# Altium schematic sheet DDR4_SODIMM_Arria10.SchDoc: DDR4 SODIMM Arria10
size B; DocumentNumber: 20; SheetNumber: 20; SheetTotal: 46
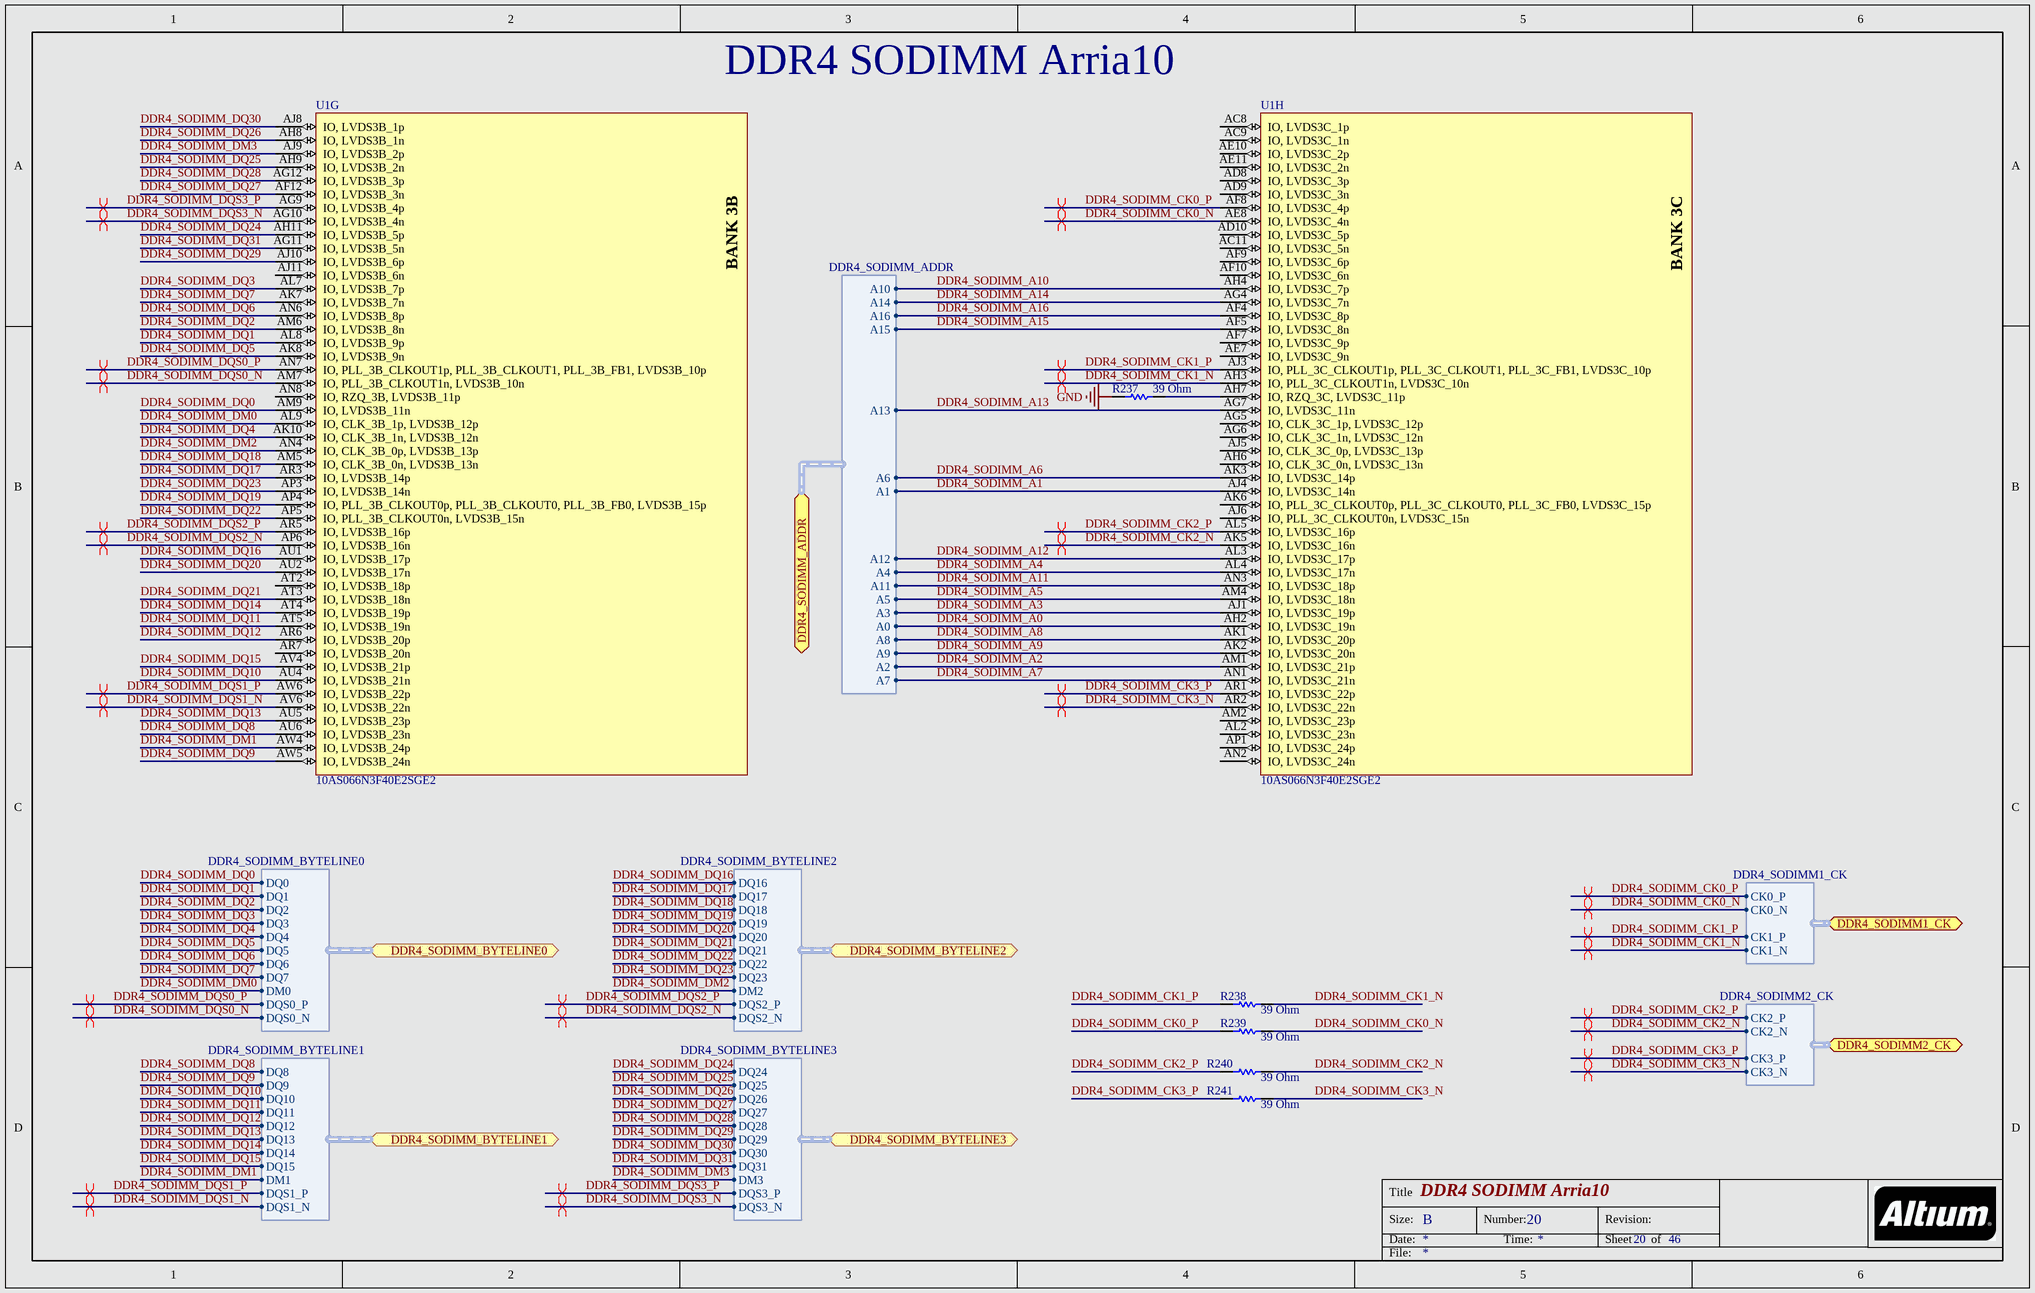
[diagram p0: DDR4_SODIMM_Arria10.SchDoc]

## Parts
R237  Resistance: 39 Ohm  [RESC1005X40X25NL5T10]  (hidden comment: RC0402JR-0739RL)
R238  Resistance: 39 Ohm  [RESC1005X40X25NL5T10]  (hidden comment: RC0402JR-0739RL)
R239  Resistance: 39 Ohm  [RESC1005X40X25NL5T10]  (hidden comment: RC0402JR-0739RL)
R240  Resistance: 39 Ohm  [RESC1005X40X25NL5T10]  (hidden comment: RC0402JR-0739RL)
R241  Resistance: 39 Ohm  [RESC1005X40X25NL5T10]  (hidden comment: RC0402JR-0739RL)
U1  10AS066N3F40E2SGE2  [ALTR-FBGA1517_A-350]  (parts G,H of 31)

## Ports
DDR4_SODIMM1_CK (harness DDR4_SODIMM1_CK), DDR4_SODIMM2_CK (harness DDR4_SODIMM2_CK), DDR4_SODIMM_ADDR (harness DDR4_SODIMM_ADDR), DDR4_SODIMM_BYTELINE0 (harness DDR4_SODIMM_BYTELINE0), DDR4_SODIMM_BYTELINE1 (harness DDR4_SODIMM_BYTELINE1), DDR4_SODIMM_BYTELINE2 (harness DDR4_SODIMM_BYTELINE2), DDR4_SODIMM_BYTELINE3 (harness DDR4_SODIMM_BYTELINE3)

## Harnesses
DDR4_SODIMM_ADDR: A10, A14, A16, A15, A13, A3, A0, A6, A1, A8, A9, A2, A7, A12, A4, A11, A5
DDR4_SODIMM1_CK: CK0_N, CK0_P, CK1_P, CK1_N
DDR4_SODIMM2_CK: CK2_N, CK2_P, CK3_P, CK3_N
DDR4_SODIMM_BYTELINE0: DQ0, DQ1, DQ2, DQ3, DQ4, DQ5, DQ6, DQ7, DM0, DQS0_P, DQS0_N
DDR4_SODIMM_BYTELINE1: DQ8, DQ9, DQ10, DQ11, DQ12, DQ13, DQ14, DQ15, DM1, DQS1_P, DQS1_N
DDR4_SODIMM_BYTELINE2: DQ16, DQ17, DQ18, DQ19, DQ20, DQ21, DQ22, DQ23, DM2, DQS2_P, DQS2_N
DDR4_SODIMM_BYTELINE3: DQ24, DQ25, DQ26, DQ27, DQ28, DQ29, DQ30, DQ31, DM3, DQS3_P, DQS3_N

## Nets
GND: R237.1
DDR4_SODIMM_A0: U1.AH2(IO,_LVDS3C_19n) ; port DDR4_SODIMM_ADDR.A0
DDR4_SODIMM_A1: U1.AJ4(IO,_LVDS3C_14n) ; port DDR4_SODIMM_ADDR.A1
DDR4_SODIMM_A2: U1.AM1(IO,_LVDS3C_21p) ; port DDR4_SODIMM_ADDR.A2
DDR4_SODIMM_A3: U1.AJ1(IO,_LVDS3C_19p) ; port DDR4_SODIMM_ADDR.A3
DDR4_SODIMM_A4: U1.AL4(IO,_LVDS3C_17n) ; port DDR4_SODIMM_ADDR.A4
DDR4_SODIMM_A5: U1.AM4(IO,_LVDS3C_18n) ; port DDR4_SODIMM_ADDR.A5
DDR4_SODIMM_A6: U1.AK3(IO,_LVDS3C_14p) ; port DDR4_SODIMM_ADDR.A6
DDR4_SODIMM_A7: U1.AN1(IO,_LVDS3C_21n) ; port DDR4_SODIMM_ADDR.A7
DDR4_SODIMM_A8: U1.AK1(IO,_LVDS3C_20p) ; port DDR4_SODIMM_ADDR.A8
DDR4_SODIMM_A9: U1.AK2(IO,_LVDS3C_20n) ; port DDR4_SODIMM_ADDR.A9
DDR4_SODIMM_A10: U1.AH4(IO,_LVDS3C_7p) ; port DDR4_SODIMM_ADDR.A10
DDR4_SODIMM_A11: U1.AN3(IO,_LVDS3C_18p) ; port DDR4_SODIMM_ADDR.A11
DDR4_SODIMM_A12: U1.AL3(IO,_LVDS3C_17p) ; port DDR4_SODIMM_ADDR.A12
DDR4_SODIMM_A13: U1.AG7(IO,_LVDS3C_11n) ; port DDR4_SODIMM_ADDR.A13
DDR4_SODIMM_A14: U1.AG4(IO,_LVDS3C_7n) ; port DDR4_SODIMM_ADDR.A14
DDR4_SODIMM_A15: U1.AF5(IO,_LVDS3C_8n) ; port DDR4_SODIMM_ADDR.A15
DDR4_SODIMM_A16: U1.AF4(IO,_LVDS3C_8p) ; port DDR4_SODIMM_ADDR.A16
DDR4_SODIMM_CK0_N: R239.2 U1.AE8(IO,_LVDS3C_4n) ; port DDR4_SODIMM1_CK.CK0_N
DDR4_SODIMM_CK0_P: R239.1 U1.AF8(IO,_LVDS3C_4p) ; port DDR4_SODIMM1_CK.CK0_P
DDR4_SODIMM_CK1_N: R238.2 U1.AH3(IO,_PLL_3C_CLKOUT1n,_LVDS3C_10n) ; port DDR4_SODIMM1_CK.CK1_N
DDR4_SODIMM_CK1_P: R238.1 U1.AJ3(IO,_PLL_3C_CLKOUT1p,_PLL_3C_CLKOUT1,_PLL_3C_FB1,_LVDS3C_10p) ; port DDR4_SODIMM1_CK.CK1_P
DDR4_SODIMM_CK2_N: R240.2 U1.AK5(IO,_LVDS3C_16n) ; port DDR4_SODIMM2_CK.CK2_N
DDR4_SODIMM_CK2_P: R240.1 U1.AL5(IO,_LVDS3C_16p) ; port DDR4_SODIMM2_CK.CK2_P
DDR4_SODIMM_CK3_N: R241.2 U1.AR2(IO,_LVDS3C_22n) ; port DDR4_SODIMM2_CK.CK3_N
DDR4_SODIMM_CK3_P: R241.1 U1.AR1(IO,_LVDS3C_22p) ; port DDR4_SODIMM2_CK.CK3_P
DDR4_SODIMM_DM0: U1.AL9(IO,_CLK_3B_1p,_LVDS3B_12p) ; port DDR4_SODIMM_BYTELINE0.DM0
DDR4_SODIMM_DM1: U1.AW4(IO,_LVDS3B_24p) ; port DDR4_SODIMM_BYTELINE1.DM1
DDR4_SODIMM_DM2: U1.AN4(IO,_CLK_3B_0p,_LVDS3B_13p) ; port DDR4_SODIMM_BYTELINE2.DM2
DDR4_SODIMM_DM3: U1.AJ9(IO,_LVDS3B_2p) ; port DDR4_SODIMM_BYTELINE3.DM3
DDR4_SODIMM_DQ0: U1.AM9(IO,_LVDS3B_11n) ; port DDR4_SODIMM_BYTELINE0.DQ0
DDR4_SODIMM_DQ1: U1.AL8(IO,_LVDS3B_9p) ; port DDR4_SODIMM_BYTELINE0.DQ1
DDR4_SODIMM_DQ2: U1.AM6(IO,_LVDS3B_8n) ; port DDR4_SODIMM_BYTELINE0.DQ2
DDR4_SODIMM_DQ3: U1.AL7(IO,_LVDS3B_7p) ; port DDR4_SODIMM_BYTELINE0.DQ3
DDR4_SODIMM_DQ4: U1.AK10(IO,_CLK_3B_1n,_LVDS3B_12n) ; port DDR4_SODIMM_BYTELINE0.DQ4
DDR4_SODIMM_DQ5: U1.AK8(IO,_LVDS3B_9n) ; port DDR4_SODIMM_BYTELINE0.DQ5
DDR4_SODIMM_DQ6: U1.AN6(IO,_LVDS3B_8p) ; port DDR4_SODIMM_BYTELINE0.DQ6
DDR4_SODIMM_DQ7: U1.AK7(IO,_LVDS3B_7n) ; port DDR4_SODIMM_BYTELINE0.DQ7
DDR4_SODIMM_DQ8: U1.AU6(IO,_LVDS3B_23n) ; port DDR4_SODIMM_BYTELINE1.DQ8
DDR4_SODIMM_DQ9: U1.AW5(IO,_LVDS3B_24n) ; port DDR4_SODIMM_BYTELINE1.DQ9
DDR4_SODIMM_DQ10: U1.AU4(IO,_LVDS3B_21n) ; port DDR4_SODIMM_BYTELINE1.DQ10
DDR4_SODIMM_DQ11: U1.AT5(IO,_LVDS3B_19n) ; port DDR4_SODIMM_BYTELINE1.DQ11
DDR4_SODIMM_DQ12: U1.AR6(IO,_LVDS3B_20p) ; port DDR4_SODIMM_BYTELINE1.DQ12
DDR4_SODIMM_DQ13: U1.AU5(IO,_LVDS3B_23p) ; port DDR4_SODIMM_BYTELINE1.DQ13
DDR4_SODIMM_DQ14: U1.AT4(IO,_LVDS3B_19p) ; port DDR4_SODIMM_BYTELINE1.DQ14
DDR4_SODIMM_DQ15: U1.AV4(IO,_LVDS3B_21p) ; port DDR4_SODIMM_BYTELINE1.DQ15
DDR4_SODIMM_DQ16: U1.AU1(IO,_LVDS3B_17p) ; port DDR4_SODIMM_BYTELINE2.DQ16
DDR4_SODIMM_DQ17: U1.AR3(IO,_LVDS3B_14p) ; port DDR4_SODIMM_BYTELINE2.DQ17
DDR4_SODIMM_DQ18: U1.AM5(IO,_CLK_3B_0n,_LVDS3B_13n) ; port DDR4_SODIMM_BYTELINE2.DQ18
DDR4_SODIMM_DQ19: U1.AP4(IO,_PLL_3B_CLKOUT0p,_PLL_3B_CLKOUT0,_PLL_3B_FB0,_LVDS3B_15p) ; port DDR4_SODIMM_BYTELINE2.DQ19
DDR4_SODIMM_DQ20: U1.AU2(IO,_LVDS3B_17n) ; port DDR4_SODIMM_BYTELINE2.DQ20
DDR4_SODIMM_DQ21: U1.AT3(IO,_LVDS3B_18n) ; port DDR4_SODIMM_BYTELINE2.DQ21
DDR4_SODIMM_DQ22: U1.AP5(IO,_PLL_3B_CLKOUT0n,_LVDS3B_15n) ; port DDR4_SODIMM_BYTELINE2.DQ22
DDR4_SODIMM_DQ23: U1.AP3(IO,_LVDS3B_14n) ; port DDR4_SODIMM_BYTELINE2.DQ23
DDR4_SODIMM_DQ24: U1.AH11(IO,_LVDS3B_5p) ; port DDR4_SODIMM_BYTELINE3.DQ24
DDR4_SODIMM_DQ25: U1.AH9(IO,_LVDS3B_2n) ; port DDR4_SODIMM_BYTELINE3.DQ25
DDR4_SODIMM_DQ26: U1.AH8(IO,_LVDS3B_1n) ; port DDR4_SODIMM_BYTELINE3.DQ26
DDR4_SODIMM_DQ27: U1.AF12(IO,_LVDS3B_3n) ; port DDR4_SODIMM_BYTELINE3.DQ27
DDR4_SODIMM_DQ28: U1.AG12(IO,_LVDS3B_3p) ; port DDR4_SODIMM_BYTELINE3.DQ28
DDR4_SODIMM_DQ29: U1.AJ10(IO,_LVDS3B_6p) ; port DDR4_SODIMM_BYTELINE3.DQ29
DDR4_SODIMM_DQ30: U1.AJ8(IO,_LVDS3B_1p) ; port DDR4_SODIMM_BYTELINE3.DQ30
DDR4_SODIMM_DQ31: U1.AG11(IO,_LVDS3B_5n) ; port DDR4_SODIMM_BYTELINE3.DQ31
DDR4_SODIMM_DQS0_N: U1.AM7(IO,_PLL_3B_CLKOUT1n,_LVDS3B_10n) ; port DDR4_SODIMM_BYTELINE0.DQS0_N
DDR4_SODIMM_DQS0_P: U1.AN7(IO,_PLL_3B_CLKOUT1p,_PLL_3B_CLKOUT1,_PLL_3B_FB1,_LVDS3B_10p) ; port DDR4_SODIMM_BYTELINE0.DQS0_P
DDR4_SODIMM_DQS1_N: U1.AV6(IO,_LVDS3B_22n) ; port DDR4_SODIMM_BYTELINE1.DQS1_N
DDR4_SODIMM_DQS1_P: U1.AW6(IO,_LVDS3B_22p) ; port DDR4_SODIMM_BYTELINE1.DQS1_P
DDR4_SODIMM_DQS2_N: U1.AP6(IO,_LVDS3B_16n) ; port DDR4_SODIMM_BYTELINE2.DQS2_N
DDR4_SODIMM_DQS2_P: U1.AR5(IO,_LVDS3B_16p) ; port DDR4_SODIMM_BYTELINE2.DQS2_P
DDR4_SODIMM_DQS3_N: U1.AG10(IO,_LVDS3B_4n) ; port DDR4_SODIMM_BYTELINE3.DQS3_N
DDR4_SODIMM_DQS3_P: U1.AG9(IO,_LVDS3B_4p) ; port DDR4_SODIMM_BYTELINE3.DQS3_P
NetR237_2: R237.2 U1.AH7(IO,_RZQ_3C,_LVDS3C_11p)

Not connected (* = marked no-connect by the designer): U1 AC8(IO,_LVDS3C_1p) AC9(IO,_LVDS3C_1n) AC11(IO,_LVDS3C_5n) AD8(IO,_LVDS3C_3p) AD9(IO,_LVDS3C_3n) AD10(IO,_LVDS3C_5p) AE7(IO,_LVDS3C_9n) AE10(IO,_LVDS3C_2p) AE11(IO,_LVDS3C_2n) AF7(IO,_LVDS3C_9p) AF9(IO,_LVDS3C_6p) AF10(IO,_LVDS3C_6n) AG5(IO,_CLK_3C_1p,_LVDS3C_12p) AG6(IO,_CLK_3C_1n,_LVDS3C_12n) AH6(IO,_CLK_3C_0n,_LVDS3C_13n) AJ5(IO,_CLK_3C_0p,_LVDS3C_13p) AJ6(IO,_PLL_3C_CLKOUT0n,_LVDS3C_15n) AJ11(IO,_LVDS3B_6n) AK6(IO,_PLL_3C_CLKOUT0p,_PLL_3C_CLKOUT0,_PLL_3C_FB0,_LVDS3C_15p) AL2(IO,_LVDS3C_23n) AM2(IO,_LVDS3C_23p) AN2(IO,_LVDS3C_24n) AN8(IO,_RZQ_3B,_LVDS3B_11p) AP1(IO,_LVDS3C_24p) AR7(IO,_LVDS3B_20n) AT2(IO,_LVDS3B_18p)

## Layout directives
differential pair: DDR4_SODIMM_CK0_N, DDR4_SODIMM_CK0_P, DDR4_SODIMM_CK1_N, DDR4_SODIMM_CK1_P, DDR4_SODIMM_CK2_N, DDR4_SODIMM_CK2_P, DDR4_SODIMM_CK3_N, DDR4_SODIMM_CK3_P, DDR4_SODIMM_DQS0_N, DDR4_SODIMM_DQS0_P, DDR4_SODIMM_DQS1_N, DDR4_SODIMM_DQS1_P, DDR4_SODIMM_DQS2_N, DDR4_SODIMM_DQS2_P, DDR4_SODIMM_DQS3_N, DDR4_SODIMM_DQS3_P

## Notes on the sheet
- Title
- Size:
- Date:
- B
- Number:
- Time:
- Revision:
- Sheet
- of
- File:
- (in symbol CMP-1689-00006-3, part G) BANK 3B
- (in symbol CMP-1689-00006-3, part H) BANK 3C

## Library data of the parts
R237-R241 = CMP-2002-07994-2: Chip Resistor, 39 Ohm, +/- 5%, 0.063 W, -55 to 155 degC, 0402 (1005 Metric), RoHS, Tape and Reel; Power Rating: 63 mW; Voltage Rating (DC): 50 V; Case Code (Imperial): 0402; Mount: Surface Mount; Max Operating Temperature: 155 degC; Case Code (Metric): 1005; ComponentLink1Description: Manufacturer URL; PackageDescription: 2-Pin Surface Mount Device, Body 1 x 0.5 mm; PartNumber: RC0402JR-0739RL; ComponentLink2Description: Datasheet; Tolerance: 5%; Height: 0.35 mm; Pins: 2; Min Operating Temperature: -55 degC; Length: 1 mm; DatasheetVersion: Rev. 4, 02/2016; ComponentLink2URL: http://www.yageo.com/documents/recent/PYu-RC_Group_51_RoHS_L_04.pdf; Mounting Technology: Surface Mount; Packaging: Cut Tape; Case/Package: 0402; Package Quantity: 1; RoHSCompliant: true; REACH SVHC: No SVHC; Width: 0.5 mm; Voltage Rating: 50 V; ComponentLink1URL: http://www.yageo.com/
U1 = CMP-1689-00006-3: Arria 10 SX Family, 588 I/O Pins, 16 Fractional PLLs, 1517-Pin FBGA, Speed Grade 2, Extended Grade, RoHS; ComponentLink3Description: Package Specification; PackageVersion: Rev. 5.0, 01/2016; ComponentLink3URL: https://www.altera.com/content/dam/altera-www/global/en_US/pdfs/literature/packaging/04r00461-04.pdf; ComponentLink2Description: Datasheet; Code_JEDEC: MS-034; Mounting Technology: Surface Mount; PartNumber: 10AS066N3F40E2SGE2; PackageDescription: 1517-Pin FineLine Ball-Grid Array (FBGA), Body 40 x 40 mm, Pitch 1 mm; ComponentLink2URL: https://www.altera.com/content/dam/altera-www/global/en_US/pdfs/literature/hb/arria-10/a10_datasheet.pdf; ComponentLink1URL: https://www.altera.com/; DatasheetVersion: Rev. 2016-06-24, 06/2016; ComponentLink1Description: Manufacturer URL